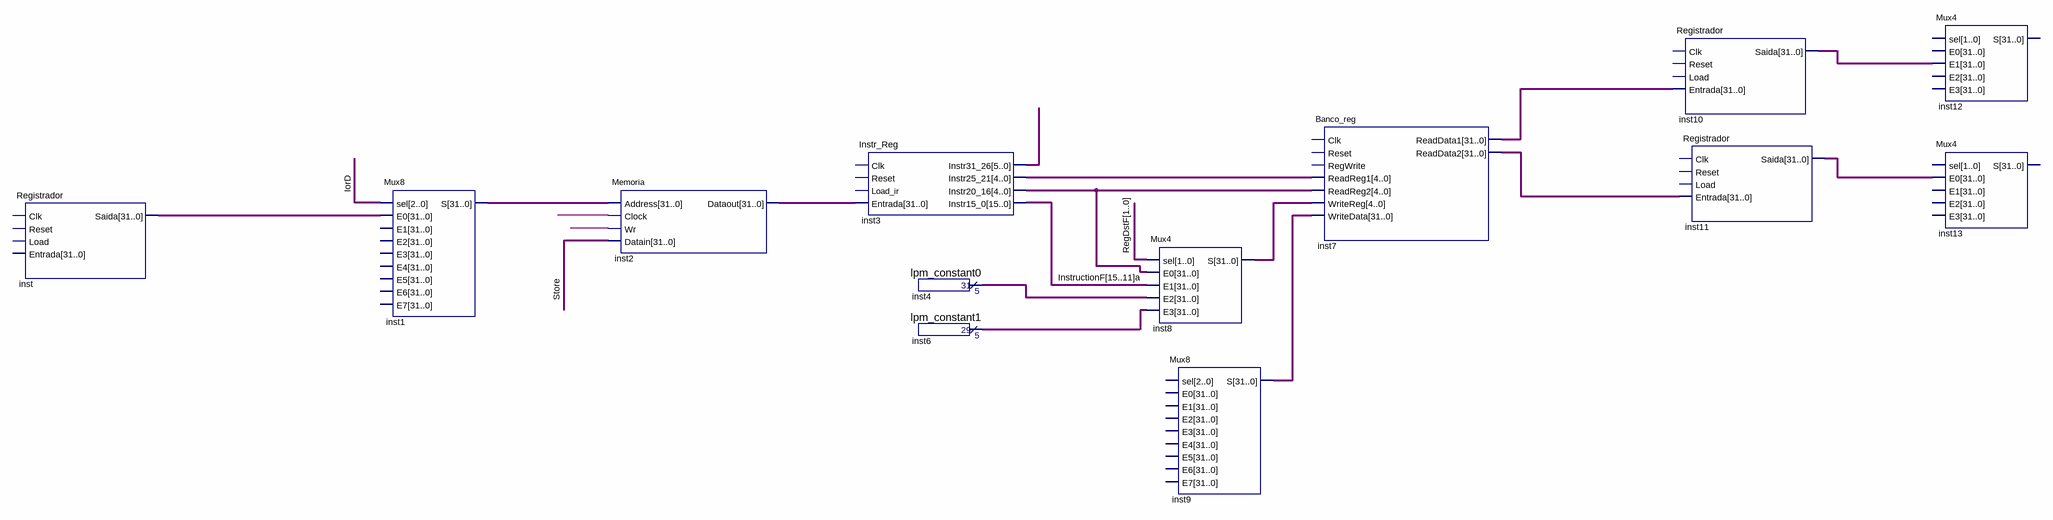
[diagram p0: schematic sheet]
// Quartus schematic ProjetoHardWare.bdf as structural Verilog: 13 symbols, 0 pins
module ProjetoHardWare (
);

  wire \InstructionF[15..11]a , IorD, Store, undriven, undriven_2;
  wire [1:0] RegDstF;
  wire [4:0] inst3_instr25_21;
  wire [5:0] inst3_instr31_26;
  wire [31:0] inst1_s, inst2_dataout, inst3_instr20_16, inst4_result, inst6_result, inst7_readdata1,
       inst7_readdata2, inst8_s, inst9_s, inst10_saida, inst11_saida, inst_saida;

  Registrador inst (.Saida(inst_saida));  // open: Clk, Reset, Load, Entrada
  Mux8 inst1 (.sel({3{IorD}}), .E0(inst_saida), .S(inst1_s));  // open: E1, E2, E3, E4, E5, E6, E7
  Memoria inst2 (.Address(inst1_s), .Clock(undriven_2), .Wr(undriven), .Datain({32{Store}}), .Dataout(inst2_dataout));
  Instr_Reg inst3 (
    .Entrada(inst2_dataout), .Instr31_26(inst3_instr31_26), .Instr25_21(inst3_instr25_21),
    .Instr20_16(inst3_instr20_16), .Instr15_0(\InstructionF[15..11]a ));  // open: Clk, Reset, Load_ir
  lpm_constant0 inst4 (.result(inst4_result));
  lpm_constant1 inst6 (.result(inst6_result));
  Mux4 inst8 (
    .sel(RegDstF), .E0(inst3_instr20_16), .E1({32{\InstructionF[15..11]a }}), .E2(inst4_result),
    .E3(inst6_result), .S(inst8_s));
  Mux8 inst9 (.S(inst9_s));  // open: sel, E0, E1, E2, E3, E4, E5, E6, E7
  Banco_reg inst7 (
    .ReadReg1(inst3_instr25_21), .ReadReg2(inst3_instr20_16), .WriteReg(inst8_s), .WriteData(inst9_s),
    .ReadData1(inst7_readdata1), .ReadData2(inst7_readdata2));  // open: Clk, Reset, RegWrite
  Registrador inst10 (.Entrada(inst7_readdata1), .Saida(inst10_saida));  // open: Clk, Reset, Load
  Registrador inst11 (.Entrada(inst7_readdata2), .Saida(inst11_saida));  // open: Clk, Reset, Load
  Mux4 inst12 (.E1(inst10_saida));  // open: sel, E0, E2, E3, S
  Mux4 inst13 (.E0(inst11_saida));  // open: sel, E1, E2, E3, S
endmodule
